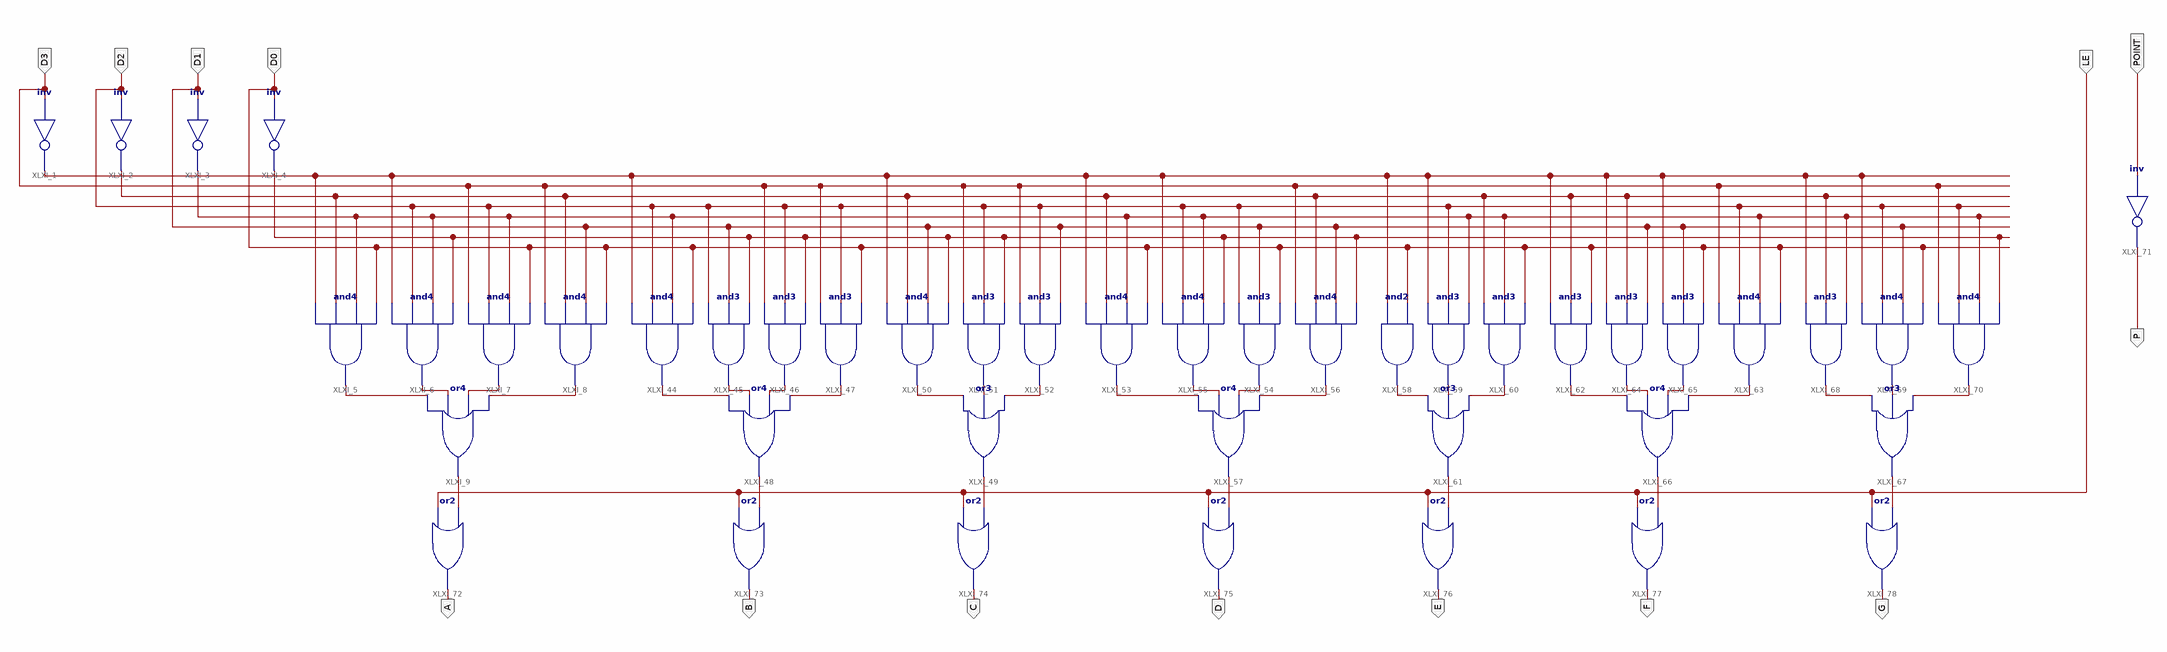
[diagram p0: schematic sheet 1]
// Xilinx ISE schematic MC14495_ZJU.sch (kintex7) as structural Verilog: 44 symbols, 14 ports
module MC14495_ZJU (
  input  D3,
  input  D2,
  input  D1,
  input  D0,
  input  POINT,
  input  LE,
  output P,
  output A,
  output B,
  output C,
  output D,
  output E,
  output F,
  output G
);

  wire XLXN_6, XLXN_7, XLXN_8, XLXN_9, XLXN_22, XLXN_23, XLXN_24, XLXN_25, XLXN_26, XLXN_27, XLXN_28,
       XLXN_29, XLXN_30, XLXN_31, XLXN_32, XLXN_33, XLXN_34, XLXN_35, XLXN_36, XLXN_37, XLXN_38, XLXN_39,
       XLXN_40, XLXN_41, XLXN_42, XLXN_43, XLXN_44, XLXN_45, XLXN_46, XLXN_50, XLXN_51, XLXN_52, XLXN_53,
       XLXN_55, XLXN_56, XLXN_57;

  not XLXI_1 (XLXN_22, D3);
  not XLXI_2 (XLXN_23, D2);
  not XLXI_3 (XLXN_24, D1);
  not XLXI_4 (XLXN_25, D0);
  and XLXI_5 (XLXN_6, XLXN_22, XLXN_23, XLXN_24, D0);
  and XLXI_6 (XLXN_7, XLXN_22, D2, XLXN_24, XLXN_25);
  and XLXI_7 (XLXN_8, D3, D2, XLXN_24, D0);
  and XLXI_8 (XLXN_9, D3, XLXN_23, D1, D0);
  or XLXI_9 (XLXN_50, XLXN_6, XLXN_7, XLXN_8, XLXN_9);
  and XLXI_44 (XLXN_29, XLXN_22, D2, XLXN_24, D0);
  and XLXI_45 (XLXN_28, D2, D1, XLXN_25);
  and XLXI_46 (XLXN_27, D3, D2, XLXN_25);
  and XLXI_47 (XLXN_26, D3, D2, D0);
  or XLXI_48 (XLXN_51, XLXN_29, XLXN_28, XLXN_27, XLXN_26);
  or XLXI_49 (XLXN_52, XLXN_30, XLXN_31, XLXN_32);
  and XLXI_50 (XLXN_30, XLXN_22, XLXN_23, D1, XLXN_25);
  and XLXI_51 (XLXN_31, D3, D2, XLXN_25);
  and XLXI_52 (XLXN_32, D3, D2, D1);
  and XLXI_53 (XLXN_33, XLXN_22, XLXN_23, XLXN_24, D0);
  and XLXI_54 (XLXN_35, D2, D1, D0);
  and XLXI_55 (XLXN_34, XLXN_22, D2, XLXN_24, XLXN_25);
  and XLXI_56 (XLXN_36, D3, XLXN_23, D1, XLXN_25);
  or XLXI_57 (XLXN_53, XLXN_33, XLXN_34, XLXN_35, XLXN_36);
  and XLXI_58 (XLXN_37, XLXN_22, D0);
  and XLXI_59 (XLXN_38, XLXN_22, D2, XLXN_24);
  and XLXI_60 (XLXN_39, XLXN_23, XLXN_24, D0);
  or XLXI_61 (XLXN_55, XLXN_37, XLXN_38, XLXN_39);
  and XLXI_62 (XLXN_40, XLXN_22, XLXN_23, D0);
  and XLXI_63 (XLXN_43, D3, D2, XLXN_24, D0);
  and XLXI_64 (XLXN_41, XLXN_22, XLXN_23, D1);
  and XLXI_65 (XLXN_42, XLXN_22, D1, D0);
  or XLXI_66 (XLXN_56, XLXN_40, XLXN_41, XLXN_42, XLXN_43);
  or XLXI_67 (XLXN_57, XLXN_44, XLXN_45, XLXN_46);
  and XLXI_68 (XLXN_44, XLXN_22, XLXN_23, XLXN_24);
  and XLXI_69 (XLXN_45, XLXN_22, D2, D1, D0);
  and XLXI_70 (XLXN_46, D3, D2, XLXN_24, XLXN_25);
  not XLXI_71 (P, POINT);
  or XLXI_72 (A, LE, XLXN_50);
  or XLXI_73 (B, LE, XLXN_51);
  or XLXI_74 (C, LE, XLXN_52);
  or XLXI_75 (D, LE, XLXN_53);
  or XLXI_76 (E, LE, XLXN_55);
  or XLXI_77 (F, LE, XLXN_56);
  or XLXI_78 (G, LE, XLXN_57);
endmodule
